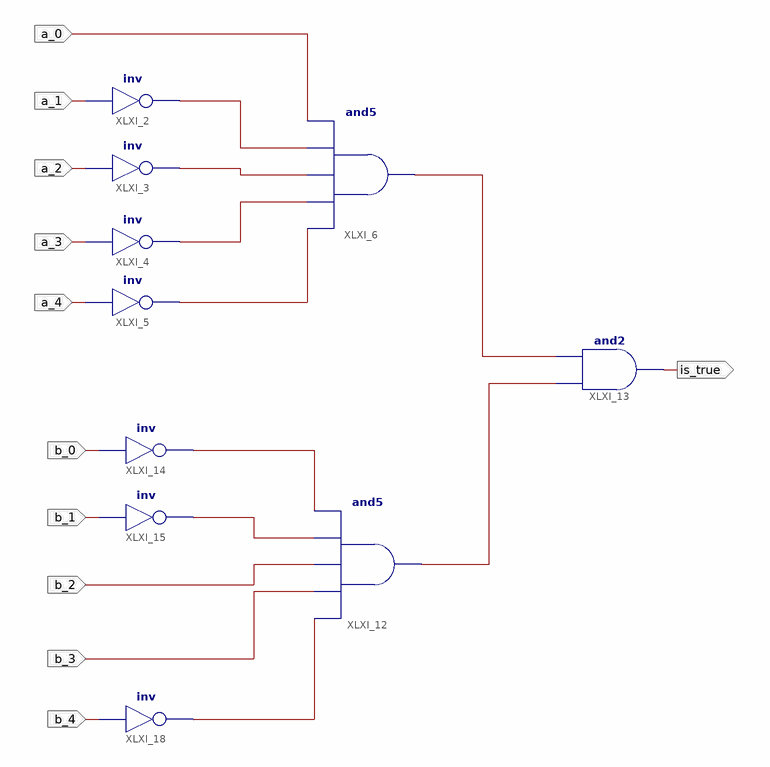
[diagram p0: schematic sheet 1]
// Xilinx ISE schematic check_12_and_1.sch (spartan3adsp) as structural Verilog: 10 symbols, 11 ports
module check_12_and_1 (
  input  a_0,
  input  a_1,
  input  a_2,
  input  a_3,
  input  a_4,
  input  b_0,
  input  b_1,
  input  b_2,
  input  b_3,
  input  b_4,
  output is_true
);

  wire XLXN_7, XLXN_8, XLXN_9, XLXN_10, XLXN_21, XLXN_22, XLXN_28, XLXN_29, XLXN_33;

  not XLXI_2 (XLXN_7, a_1);
  not XLXI_3 (XLXN_8, a_2);
  not XLXI_4 (XLXN_9, a_3);
  not XLXI_5 (XLXN_10, a_4);
  and XLXI_6 (XLXN_21, XLXN_10, XLXN_9, XLXN_8, XLXN_7, a_0);
  and XLXI_12 (XLXN_22, XLXN_33, b_3, b_2, XLXN_29, XLXN_28);
  and XLXI_13 (is_true, XLXN_22, XLXN_21);
  not XLXI_14 (XLXN_28, b_0);
  not XLXI_15 (XLXN_29, b_1);
  not XLXI_18 (XLXN_33, b_4);
endmodule
